# EAGLE design MicroMod_CAN-Bus_Function_Board (EAGLE 9.6.2)
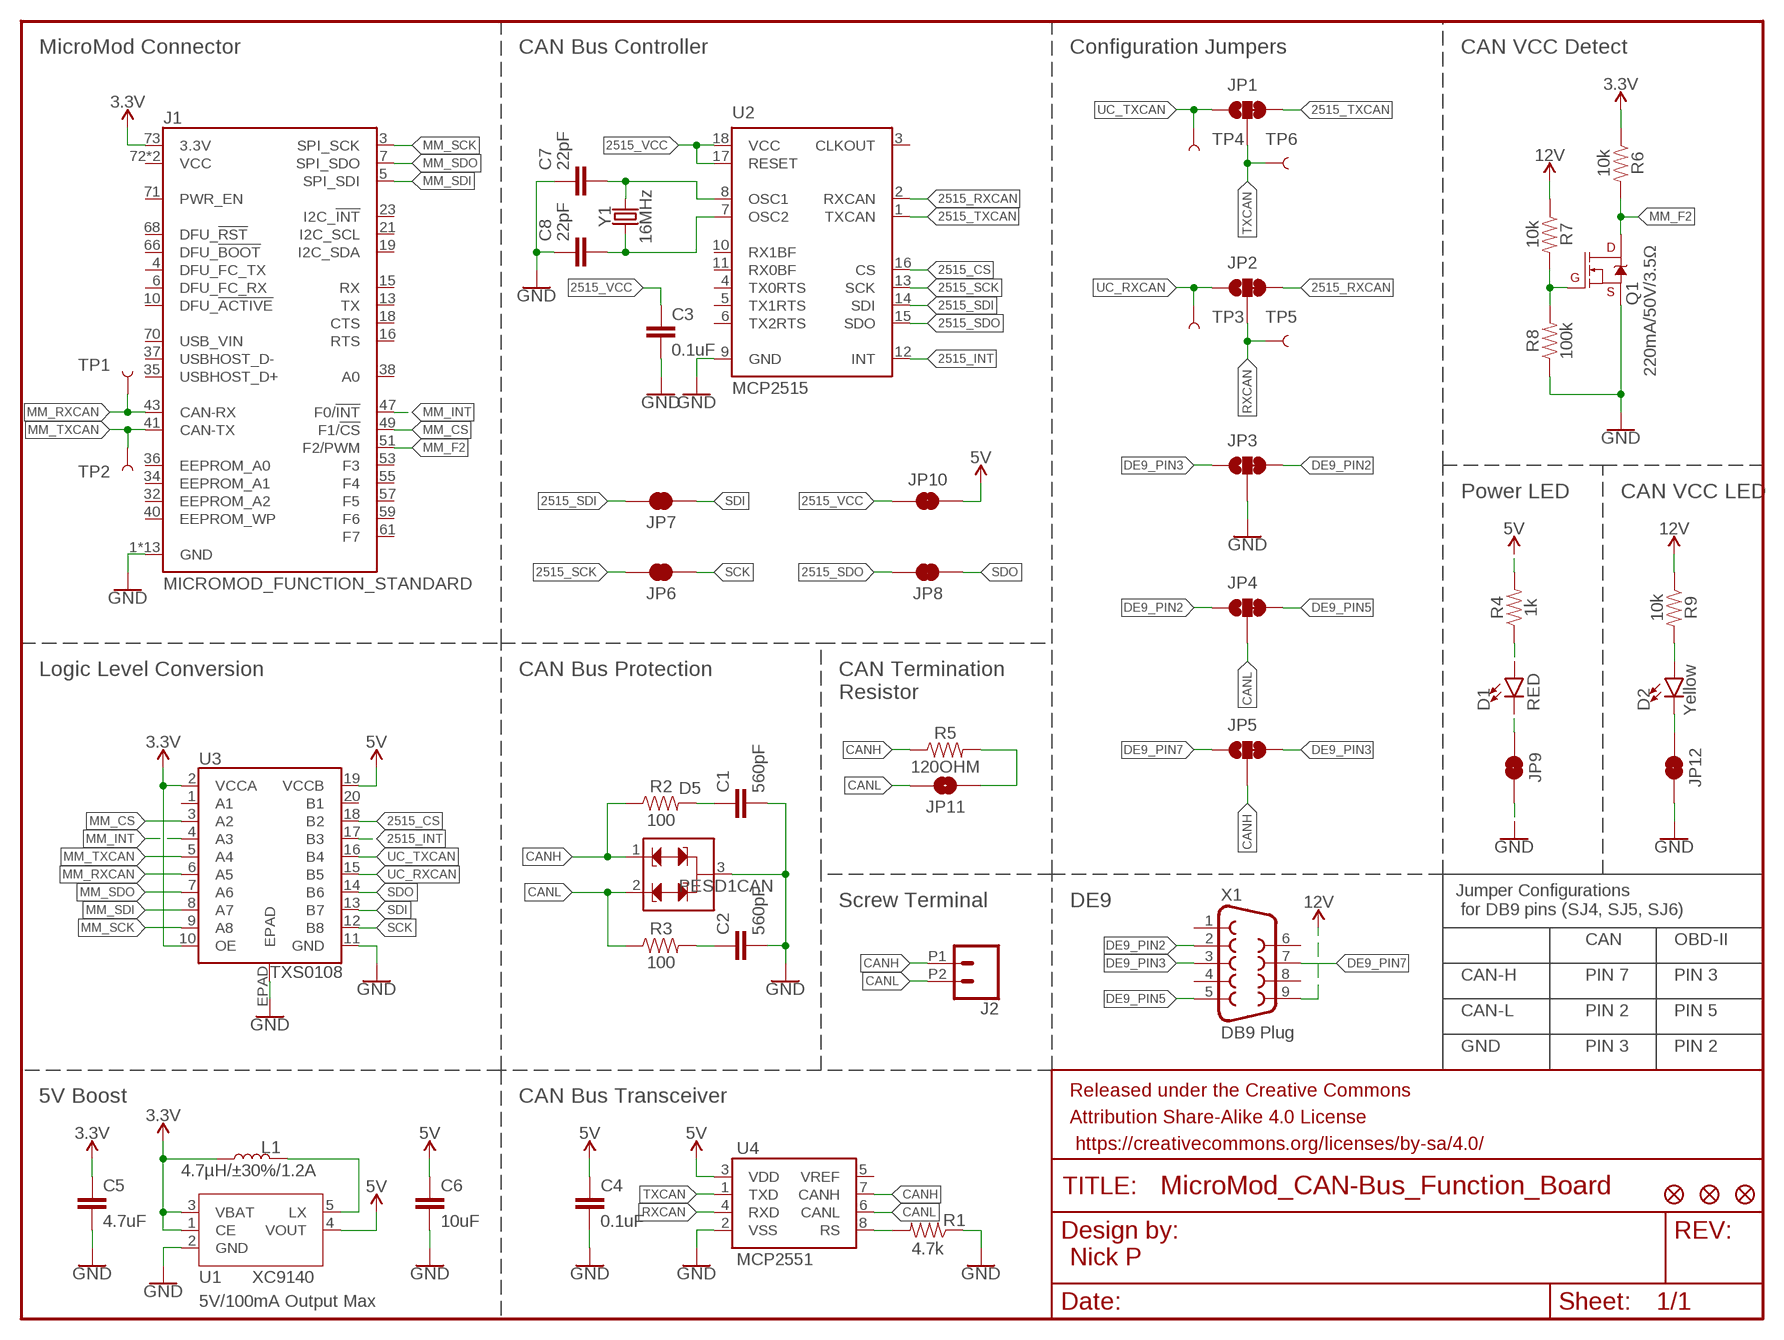
[diagram p0: schematic, sheet 1]

## Parts
C1  560pF  560PF-0603-50V-5%  [0603]
C2  560pF  560PF-0603-50V-5%  [0603]
C3  0.1uF  0.1UF-0603-25V-(+80/-20%)  [0603]
C4  0.1uF  0.1UF-0603-25V-(+80/-20%)  [0603]
C5  4.7uF  4.7UF-0603-6.3V-(10%)  [0603]
C6  10uF  10UF-0603-6.3V-20%  [0603]
C7  22pF  22PF-0603-50V-5%  [0603]
C8  22pF  22PF-0603-50V-5%  [0603]
D1  RED  LED-RED0603  [LED-0603]
D2  Yellow  LED-YELLOW0603  [LED-0603]
D5  PESD1CAN  [SOT23-3]
FD1  FIDUCIAL1X2  [FIDUCIAL-1X2]
FD2  FIDUCIAL1X2  [FIDUCIAL-1X2]
FD3  FIDUCIAL0.2MM  [FIDUCIAL-0.2MM]
FRAME1  FRAME-LETTER  [CREATIVE_COMMONS]
J1  MICROMOD_FUNCTION_STANDARD  [M.2-CARD-E-22_FUNCTION_STANDARD]
J2  CONN_022.54MM_SCREWTERM  [1X02_2.54_SCREWTERM]
JP1  JUMPER-SMT_3_1-NC_TRACE_NO-SILK  [SMT-JUMPER_3_1-NC_TRACE_NO-SILK]
JP2  JUMPER-SMT_3_1-NC_TRACE_NO-SILK  [SMT-JUMPER_3_1-NC_TRACE_NO-SILK]
JP3  JUMPER-SMT_3_1-NC_TRACE_NO-SILK  [SMT-JUMPER_3_1-NC_TRACE_NO-SILK]
JP4  JUMPER-SMT_3_1-NC_TRACE_NO-SILK  [SMT-JUMPER_3_1-NC_TRACE_NO-SILK]
JP5  JUMPER-SMT_3_1-NC_TRACE_NO-SILK  [SMT-JUMPER_3_1-NC_TRACE_NO-SILK]
JP6  JUMPER-SMT_2_NC_TRACE_NO-SILK  [SMT-JUMPER_2_NC_TRACE_NO-SILK]
JP7  JUMPER-SMT_2_NC_TRACE_NO-SILK  [SMT-JUMPER_2_NC_TRACE_NO-SILK]
JP8  JUMPER-SMT_2_NC_TRACE_NO-SILK  [SMT-JUMPER_2_NC_TRACE_NO-SILK]
JP9  JUMPER-SMT_2_NC_TRACE_NO-SILK  [SMT-JUMPER_2_NC_TRACE_NO-SILK]
JP10  JUMPER-SMT_2_NC_TRACE_NO-SILK  [SMT-JUMPER_2_NC_TRACE_NO-SILK]
JP11  JUMPER-SMT_2_NO_NO-SILK  [SMT-JUMPER_2_NO_NO-SILK]
JP12  JUMPER-SMT_2_NC_TRACE_NO-SILK  [SMT-JUMPER_2_NC_TRACE_NO-SILK]
L1  4.7µH/±30%/1.2A  INDUCTOR-CDRH-4.7UH  [INDUCTOR_4.7UH]
Q1  220mA/50V/3.5Ω  MOSFET-NCH-BSS138  [SOT23-3]
R1  4.7k  4.7KOHM-0603-1/10W-1%  [0603]
R2  100  100OHM-0603-1/10W-1%  [0603]
R3  100  100OHM-0603-1/10W-1%  [0603]
R4  1k  1KOHM-0603-1/10W-1%  [0603]
R5  120OHM  [0603]
R6  10k  10KOHM-0603-1/10W-1%  [0603]
R7  10k  10KOHM-0603-1/10W-1%  [0603]
R8  100k  100KOHM-0603-1/10W-1%  [0603]
R9  10k  10KOHM-0603-1/10W-1%  [0603]
TP1  TEST-POINT3  [PAD.03X.03]
TP2  TEST-POINT3  [PAD.03X.03]
TP3  TEST-POINT3  [PAD.03X.03]
TP4  TEST-POINT3  [PAD.03X.03]
TP5  TEST-POINT3  [PAD.03X.03]
TP6  TEST-POINT3  [PAD.03X.03]
U1  XC9140  [SOT23-5]
U2  MCP2515  MCP2515(MCP2510)SO  [SO18W]
U3  TXS0108  TXS0108-VFQFN_20  [VFQFN-20]
U4  MCP2551  [SO08]
X1  DB9 Plug  DB9MALE  [DB9_MALE]
Y1  16MHz  CRYSTAL-16MHZSMD-2X1.6  [CRYSTAL-SMD-2.0X1.6MM]

## Nets
3.3V: C5.1 J1.73(3.3V) L1.P$2 R6.1 U1.1(CE) U1.3(VBAT) U3.2(VCCA) U3.10(OE)
5V: C4.1 C6.1 JP10.2 R4.2 U1.4(VOUT) U3.19(VCCB) U4.3(VDD)
12V: R7.1 R9.1 X1.9
2515_CS: U2.16(CS) U3.18(B2)
2515_INT: U2.12(INT) U3.17(B3)
2515_RXCAN: JP2.3 U2.2(RXCAN)
2515_SCK: JP6.2 U2.13(SCK)
2515_SDI: JP7.2 U2.14(SDI)
2515_SDO: JP8.2 U2.15(SDO)
2515_TXCAN: JP1.3 U2.1(TXCAN)
2515_VCC: C3.1 JP10.1 U2.17(RESET) U2.18(VCC)
CANH: D5.1 J2.P1 JP5.2 R2.1 R5.1 U4.7(CANH)
CANL: D5.2 J2.P2 JP4.2 JP11.2 R3.1 U4.6(CANL)
DE9_PIN2: JP3.3 JP4.1 X1.2
DE9_PIN3: JP3.1 JP5.3 X1.3
DE9_PIN5: JP4.3 X1.5
DE9_PIN7: JP5.1 X1.7
GND: C1.2 C2.2 C3.2 C4.2 C5.2 C6.2 C7.1 C8.1 D5.3 J1.1(GND) J1.2(GND) J1.8(GND) J1.33(GND) J1.39(GND) J1.45(GND) J1.75(GND) J1.GND1(GND) J1.GND2(GND) J1.GND3(GND) J1.GND4(GND) J1.GND5(GND) J1.GND6(GND) JP3.2 JP9.2 JP12.2 Q1.2(S) R1.1 R8.1 U1.2(GND) U2.9(GND) U3.11(GND) U4.2(VSS)
MM_CS: J1.49(F1/!CS!) U3.3(A2)
MM_F2: J1.51(F2/PWM) Q1.3(D) R6.2
MM_INT: J1.47(F0/!INT!) U3.4(A3)
MM_RXCAN: J1.43(CAN-RX) TP1.1 U3.6(A5)
MM_SCK: J1.3(SPI_SCK) U3.9(A8)
MM_SDI: J1.5(SPI_SDI) U3.8(A7)
MM_SDO: J1.7(SPI_SDO) U3.7(A6)
MM_TXCAN: J1.41(CAN-TX) TP2.1 U3.5(A4)
N$1: C1.1 R2.2
N$2: C2.1 R3.2
N$3: C7.2 U2.8(OSC1) Y1.3
N$4: L1.P$1 U1.5(LX)
N$5: C8.2 U2.7(OSC2) Y1.1
N$6: JP11.1 R5.2
N$7: D1.C JP9.1
N$8: D1.A R4.1
N$9: R1.2 U4.8(RS)
N$10: Q1.1(G) R7.2 R8.2
N$11: D2.A R9.2
N$12: D2.C JP12.1
N$13: U3.EPAD ; supply symbol labelled GND
RXCAN: JP2.2 TP5.1 U4.4(RXD)
SCK: JP6.1 U3.12(B8)
SDI: JP7.1 U3.13(B7)
SDO: JP8.1 U3.14(B6)
TXCAN: JP1.2 TP6.1 U4.1(TXD)
UC_RXCAN: JP2.1 TP3.1 U3.15(B5)
UC_TXCAN: JP1.1 TP4.1 U3.16(B4)
Unconnected: J1.4(DFU_FC_TX) J1.6(DFU_FC_RX) J1.10(DFU_!ACTIVE!) J1.13(TX) J1.15(RX) J1.16(RTS) J1.18(CTS) J1.19(I2C_SDA) J1.21(I2C_SCL) J1.23(I2C_!INT!) J1.32(EEPROM_A2) J1.34(EEPROM_A1) J1.35(USBHOST_D+) J1.36(EEPROM_A0) J1.37(USBHOST_D-) J1.38(A0) J1.40(EEPROM_WP) J1.53(F3) J1.55(F4) J1.57(F5) J1.59(F6) J1.61(F7) J1.66(DFU_!BOOT!) J1.68(DFU_!RST!) J1.70(USB_VIN) J1.71(PWR_EN) J1.72(VCC) J1.74(VCC) U2.3(CLKOUT) U2.4(TX0RTS) U2.5(TX1RTS) U2.6(TX2RTS) U2.10(RX1BF) U2.11(RX0BF) U3.1(A1) U3.20(B1) U4.5(VREF) X1.1 X1.4 X1.6 X1.8

## Notes on the sheet
- MicroMod Connector | CAN Bus Controller | Configuration Jumpers | CAN VCC Detect
- Power LED | CAN VCC LED
- Logic Level Conversion | CAN Bus Protection
- CAN Termination
  Resistor
- Screw Terminal | DE9
- Jumper Configurations
   for DB9 pins (SJ4, SJ5, SJ6)
- CAN | OBD-II
- CAN-H | PIN 7 | PIN 3
- CAN-L | PIN 2 | PIN 5
- GND | PIN 3 | PIN 2
- 5V Boost | CAN Bus Transceiver
- Nick P
- 5V/100mA Output Max

## Library data of the parts
C1 C2 = SparkFun-Capacitors:560PF: 0.56nF/560pF ceramic capacitors A capacitor is a passive two-terminal electrical component used to store electrical energy temporarily in an electric field.; PROD_ID: CAP-08749
C3 C4 = SparkFun-Capacitors:0.1UF: 0.1µF ceramic capacitors A capacitor is a passive two-terminal electrical component used to store electrical energy temporarily in an electric field.; PROD_ID: CAP-00810
C5 = SparkFun-Capacitors:4.7UF: 4.7µF ceramic capacitors A capacitor is a passive two-terminal electrical component used to store electrical energy temporarily in an electric field.; PROD_ID: CAP-08280
C6 = SparkFun-Capacitors:10UF: 10.0µF ceramic capacitors A capacitor is a passive two-terminal electrical component used to store electrical energy temporarily in an electric field.; PROD_ID: CAP-11015
C7 C8 = SparkFun-Capacitors:22PF: 22pF ceramic capacitors A capacitor is a passive two-terminal electrical component used to store electrical energy temporarily in an electric field.; PROD_ID: CAP-07876
D1 = SparkFun-LED:LED-RED: Red SMD LED Used in manufacturing of most products at SparkFun Packages: 0603 - SMD 0603 package [Product Link] <http://docs.avagotech.com/docs/AV02-0551EN> 0603 SMART - SMD 0603 SMART package ( more efficient and expensive)[Product Link] <http://www.osram-os.com/Graphics/XPic2/00077099_0.pdf> 1206 - SMD1206 package [Product Link] <https://www.sparkfun.com/datasheets/DevTools/LilyPad/Q150OVS4.pdff> SparkFun Products: Pro Mini 328 -5V <https://www.sparkfun.com/products/821> RedBoard <https://www.sparkfun.com/products/12757> IOIO-OTG <https://www.sparkfun.com/products/13613>; PROD_ID: DIO-00819
D2 = SparkFun-LED:LED-YELLOW: Yellow SMD LED Used in manufacturing several products at SparkFun. Packages: 0603 - SMD 0603 package[Product Link] <http://www.kingbrightusa.com/product.asp?catalog_name=LED&product_id=APT1608SYCK> 0603 -SMART - SMART SMD 0603 package (more efficient/more expensive) [Product Link] <http://www.osram-os.com/osram_os/en/products/product-catalog/led-light-emitting-diodes/smartled-0603/ly-l29k/index.jsp> LilyPad - SMD1206 package[Product Datasheet] <https://www.sparkfun.com/datasheets/DevTools/LilyPad/Q150YUS4.pdf> SparkFun Products: Blynk Board <https://www.sparkfun.com/products/13794> IOIO-OTG <https://www.sparkfun.com/products/13613> XBee Explorer Serial <https://www.sparkfun.com/products/13225>; PROD_ID: DIO-09003
D5 = SparkFun-DiscreteSemi:PESD1CAN: CAN bus ESD protection diode PESD1CAN is used to protect two CAN bus lines from ESD. Link to datasheet <http://www.nxp.com/documents/data_sheet/PESD1CAN-U.pdf> SparkFun Products: SparkFun CAN-BUS Shield <https://www.sparkfun.com/products/13262>; PROD_ID: DIO-12501
FD1-FD3 = SparkFun-Aesthetics:FIDUCIAL: Fiducial Alignment Points Point-of-reference for pick-and-place machines and other optical instruments.
FRAME1 = SparkFun-Aesthetics:FRAME-LETTER: Schematic Frame - Letter Standard 8.5x11 US Letter frame
J1 = SparkFun-MicroMod:MICROMOD_FUNCTION: MicroMod Connector Description: A card edge connector and mating PCB connector to allow various MicroMod Processor Boards to be coupled with various carrier boards of different capabilities. Based on the M.2 standard.
J2 = SparkFun-Connectors:CONN_02: Multi connection point. Often used as Generic Header-pin footprint for 0.1 inch spaced/style header connections On any of the 0.1 inch spaced packages, you can populate with these: Break Away Headers - Straight <https://www.sparkfun.com/products/116> (PRT-00116) Break Away Male Headers - Right Angle <https://www.sparkfun.com/products/553> (PRT-00553) Female Headers <https://www.sparkfun.com/products/115> (PRT-00115) Break Away Headers - Machine Pin <https://www.sparkfun.com/products/117> (PRT-00117) Break Away Female Headers - Swiss Machine Pin <https://www.sparkfun.com/products/743> (PRT-00743) For SCREWTERMINALS and SPRING TERMINALS visit here: Screw Terimnals on SparkFun.com <https://www.sparkfun.com/search/results?term=Screw+Terminals> (5mm/3.5mm/2.54mm spacing) This device is also useful as a general connection point to wire up your design to another part of your project. Our various solder wires solder well into these plated through hole pads. Hook-Up Wire - Assortment (Stranded, 22 AWG) <https://www.sparkfun.com/products/11375> (PRT-11375) Hook-Up Wire - Assortment (Solid Core, 22 AWG) <https://www.sparkfun.com/products/11367> (PRT-11367) View the entire wire category on our website here <https://www.sparkfun.com/categories/141> Special notes: Molex polarized connector foot print use with: PRT-08233 with associated crimp pins and housings. 2.54_SCREWTERM for use with PRT-10571. 3.5mm Screw Terminal footprints for PRT-08084 5mm Screw Terminal footprints for use with PRT-08432
JP1-JP5 = SparkFun-Jumpers:JUMPER-SMT_3_1-NC_TRACE: Normally closed trace jumper (1 of 2 connections) This jumper has a trace between two pads so it's normally closed (NC). The other connection is normally open (NO). Use a razor knife to open the connection. For best results follow the IPC guidelines for cutting traces: Cutout at least 0.063 mm (0.005 in). Remove all loose material to clean up the cut area. Seal the cut with an approved epoxy. Reapply solder to reclose the connection, or to close the NO connection.
JP6-JP10 JP12 = SparkFun-Jumpers:JUMPER-SMT_2_NC_TRACE: Normally closed trace jumper This jumper has a trace between two pads so it's normally closed (NC). Use a razor knife to open the connection. For best results follow the IPC guidelines for cutting traces: Cutout at least 0.063 mm (0.005 in). Remove all loose material to clean up the cut area. Seal the cut with an approved epoxy. Reapply solder to reclose the connection.
JP11 = SparkFun-Jumpers:JUMPER-SMT_2_NO: Normally open jumper This jumper has two pads in close proximity to each other. Apply solder to close the connection. Round pads are easier to solder for beginners, but are a lot larger. SparkFun Product that uses the round pads: SparkFun EL Sequencer <https://www.sparkfun.com/products/12781>
L1 = SparkFun-Coils:INDUCTOR: Inductors Resist changes in electrical current. Basically a coil of wire. SparkFun Products: SparkFun Load Cell Amplifier - HX711 <https://www.sparkfun.com/products/13879> IOIO-OTG - V2.2 <https://www.sparkfun.com/products/13613>; PROD_ID: NDUC-10146
Q1 = SparkFun-DiscreteSemi:MOSFET-NCH: N-channel MOSFETs Voltage controlled devices that allow control of high current outputs. SparkFun Products: SparkFun OpenScale <https://www.sparkfun.com/products/13261> SparkFun Digital Sandbox <https://www.sparkfun.com/products/12651> SparkFun Monster Moto Shield <https://www.sparkfun.com/products/10182> SparkFun MOSFET Power Controller <https://www.sparkfun.com/products/11214>; PROD_ID: TRANS-00830
R1 = SparkFun-Resistors:4.7KOHM: 4.7kΩ resistor A resistor is a passive two-terminal electrical component that implements electrical resistance as a circuit element. Resistors act to reduce current flow, and, at the same time, act to lower voltage levels within circuits. - Wikipedia; PROD_ID: RES-07857
R2 R3 = SparkFun-Resistors:100OHM: 100Ω resistor A resistor is a passive two-terminal electrical component that implements electrical resistance as a circuit element. Resistors act to reduce current flow, and, at the same time, act to lower voltage levels within circuits. - Wikipedia; PROD_ID: RES-07863
R4 = SparkFun-Resistors:1KOHM: 1kΩ resistor A resistor is a passive two-terminal electrical component that implements electrical resistance as a circuit element. Resistors act to reduce current flow, and, at the same time, act to lower voltage levels within circuits. - Wikipedia; PROD_ID: RES-07856
R5 = SparkFun-Resistors:120OHM: 120Ω resistor A resistor is a passive two-terminal electrical component that implements electrical resistance as a circuit element. Resistors act to reduce current flow, and, at the same time, act to lower voltage levels within circuits. - Wikipedia
R6 R7 R9 = SparkFun-Resistors:10KOHM: 10kΩ resistor A resistor is a passive two-terminal electrical component that implements electrical resistance as a circuit element. Resistors act to reduce current flow, and, at the same time, act to lower voltage levels within circuits. - Wikipedia; PROD_ID: RES-00824
R8 = SparkFun-Resistors:100KOHM: 100kΩ resistor A resistor is a passive two-terminal electrical component that implements electrical resistance as a circuit element. Resistors act to reduce current flow, and, at the same time, act to lower voltage levels within circuits. - Wikipedia; PROD_ID: RES-07828
TP1-TP6 = SparkFun-Connectors:TEST-POINT: SparkFun Test Points Bare copper test points for troubleshooting or In-Circuit-Testing. These are used by our Production team for verifying production board runs using pogo-pins on test beds. SparkFun Products: SparkFun LSM9DS1 Breakout <https://www.sparkfun.com/products/13284> SparkFun PSOC <https://www.sparkfun.com/products/13714> SparkFun Load Cell Amplifier <https://www.sparkfun.com/products/13879>
U1 = SparkFun-IC-Power:XC9140
U2 = SparkFun-IC-Comms:MCP2515(MCP2510): CAN controller with SPI interface The MCP2515 controller supercedes the MCP2510 while addressing all errata associated with it. The two devices are pin compatible, either can be used with this device. 18-pin package SOIC Simple SPI interface to any MCU. One-shot mode ensures message transmission is attempted only once Databyte filtering Start-of-Frame (SOF) output Low-power CMOS Technology Datasheet <http://www.sparkfun.com/datasheets/DevTools/Arduino/MCP2515.pdf> SparkFun Products CAN-BUS Shield <https://www.sparkfun.com/products/13262> (DEV-13262); PROD_ID: IC-09906
U3 = SparkFun-IC-Comms:TXS0108: 8-Bit Bi-Directional Level Shifter For Open-Drain and Push-Pull 1.2V-3.6V (VCCA) to 1.65V-5.5V (VCCB) bi-directional level shifter with auto direction sensing. Max data rate - VCCA 1.2V: 20Mbps (50ns), VCCA 3.3V: 100Mbps (10ns) Digikey: 296-24806-2-ND (20-VFDFN) SparkFun Products Example Product (SKU); PROD_ID: IC-14343
U4 = SparkFun-IC-Comms:MCP2551: MCP2551 High Speed CAN Transceiver High speed CAN transceiver Datasheet <http://www.sparkfun.com/datasheets/DevTools/Arduino/MCP2551.pdf> SparkFun Products CAN-BUS Shield <https://www.sparkfun.com/products/13262> (DEV-13262) SparkFun OBD-II UART <https://www.sparkfun.com/products/9555> (WIG-09555); PROD_ID: IC-09907
X1 = SparkFun-Connectors:DB9: DB9 Connector Standard DB9 (D-Sub 9) serial connector. Can be used for CAN bus as well as RS485 and RS232. Footprint production proven. Spark Fun Electronics SKU : PRT-00429; PROD_ID: CONN-09904
Y1 = SparkFun-Clocks:CRYSTAL-16MHZ: 16MHz Crystal Digikey Example <http://www.digikey.com/product-search/en?keywords=535-9122-1-ND> Frequency: 16MHz Frequency Stability: ±50ppm Frequency Tolerance: ±20ppm Load Capacitance: 18pF SparkFun Products: Pro Micro -5V/16MHz <https://www.sparkfun.com/products/12640> SparkFun Serial Enabled LCD Kit <https://www.sparkfun.com/products/10097>; PROD_ID: XTAL-14681

## Net classes
0 default: width 0 mm, drill 0 mm

## Board
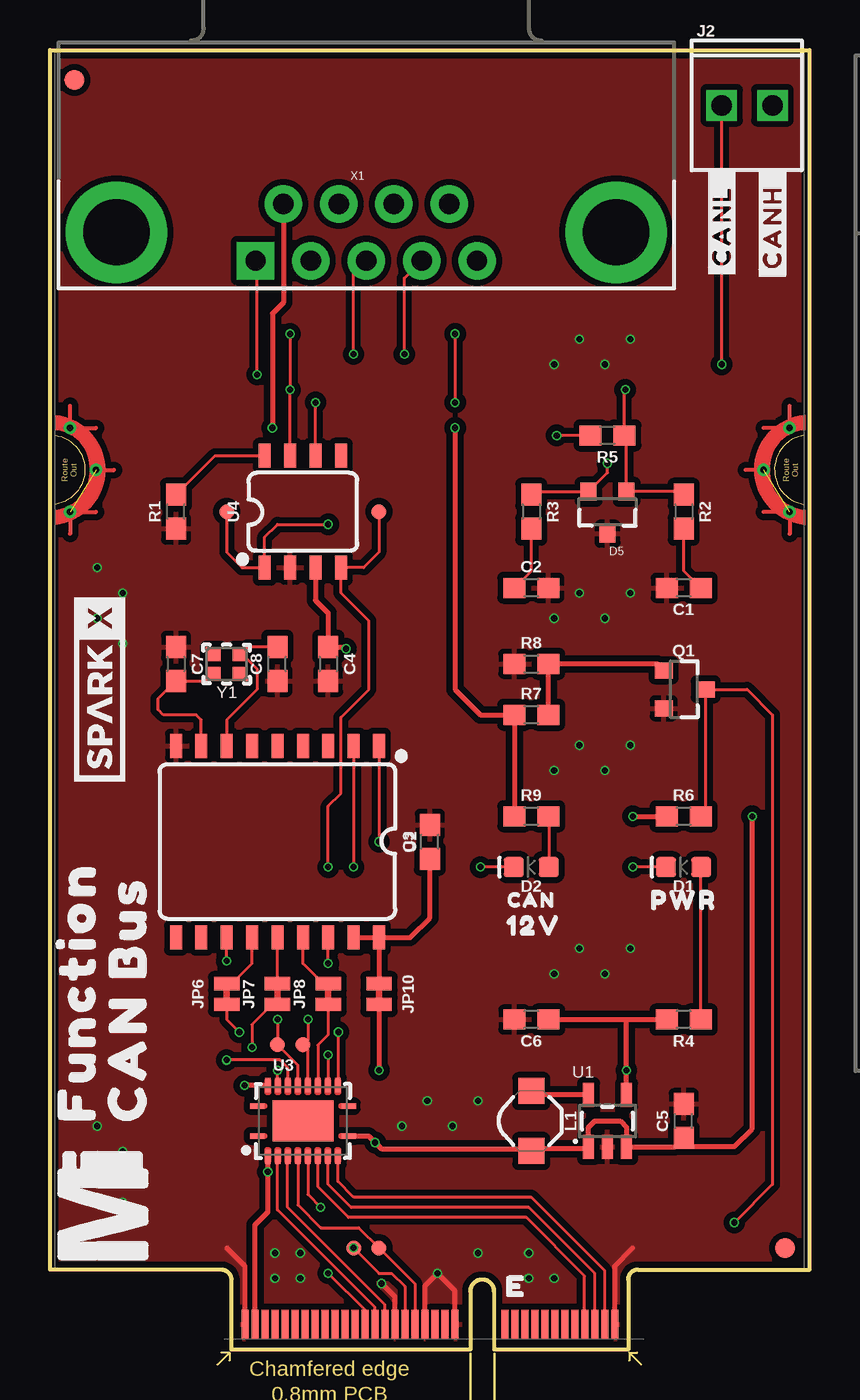
[diagram p1: board, top side]
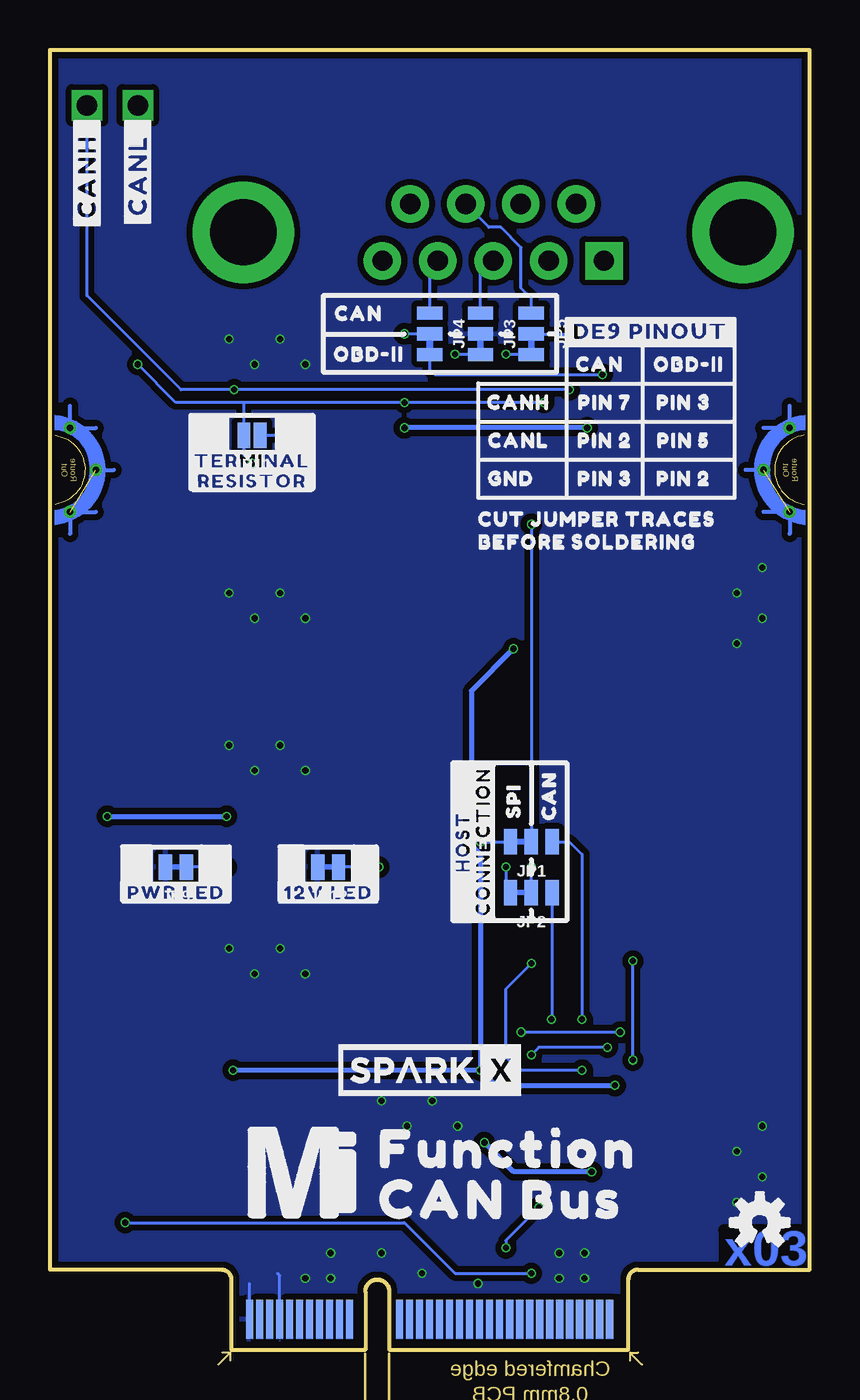
[diagram p2: board, bottom side, seen from below]

Size 38 x 65 mm. Coordinates in mm from the lower left corner, seen from the top.
Outline: 28.93,0 22.22,0 22.22,2.9 arc180 21.02,2.9 21.02,0 9.07,0 9.07,3.5 arc84 8.6,4 0,4 0,65 38,65 38,4 29.4,4 arc85 28.93,3.5 28.93,0
Copper layers (1+2*15+16): Top 0.035mm / dielectric 1.5mm / Route2 0.035mm / dielectric 0.15mm / Route15 0.035mm / dielectric 0.2mm / Bottom 0.035mm
Design rules "SparkFun-4-Layer-MicroMod-JLCPCB": minimum track width 4mil, minimum drill 0.2mm, track to track 4mil, track to pad 4mil, pad to pad 4mil, via to via 4mil, smd to smd 4mil, copper to edge 6mil, drill to drill 6mil, minimum pad ring 3mil, minimum via ring 3mil, stop-mask expansion 4mil, vias tented up to drill 25mil, thermal gap 10mil

### Footprints (pad centres in the part's own frame; a part is rotated, then mirrored left to right if it is on the bottom)
0603 = smd 1.1 x 1: 1 -0.85,0; 2 0.85,0
LED-0603 = smd 1 x 1: A -0.877,0; C 0.877,0
SOT23-3 = smd 0.8 x 0.9: 1 -0.95,-1; 2 0.95,-1; 3 0,1.1
FIDUCIAL-1X2 = smd 1 x 1: 1 0,0
FIDUCIAL-0.2MM = smd 0.2 x 0.2: 1 0,0
M.2-CARD-E-22_FUNCTION_STANDARD = smd 0.35 x 1.45: 1 9.25,1.275; 3 8.75,1.275; 5 8.25,1.275; 7 7.75,1.275; 9 7.25,1.275; 11 6.75,1.275; 13 6.25,1.275; 15 5.75,1.275; 17 5.25,1.275; 19 4.75,1.275; 21 4.25,1.275; 23 3.75,1.275; 33 1.25,1.275; 35 0.75,1.275; 37 0.25,1.275; 39 -0.25,1.275; 41 -0.75,1.275; 43 -1.25,1.275; 45 -1.75,1.275; 47 -2.25,1.275; 49 -2.75,1.275; 51 -3.25,1.275; 53 -3.75,1.275; 55 -4.25,1.275; 57 -4.75,1.275; 59 -5.25,1.275; 61 -5.75,1.275; 63 -6.25,1.275; 65 -6.75,1.275; 67 -7.25,1.275; 69 -7.75,1.275; 71 -8.25,1.275; 73 -8.75,1.275; 75 -9.25,1.275 | smd 0.35 x 1.95 bottom: 2 9,1.525; 4 8.5,1.525; 6 8,1.525; 8 7.5,1.525; 10 7,1.525; 12 6.5,1.525; 14 6,1.525; 16 5.5,1.525; 18 5,1.525; 20 4.5,1.525; 22 4,1.525; 32 1.5,1.525; 34 1,1.525; 36 0.5,1.525; 38 0,1.525; 40 -0.5,1.525; 42 -1,1.525; 44 -1.5,1.525; 46 -2,1.525; 48 -2.5,1.525; 50 -3,1.525; 52 -3.5,1.525; 54 -4,1.525; 56 -4.5,1.525; 58 -5,1.525; 60 -5.5,1.525; 62 -6,1.525; 64 -6.5,1.525; 66 -7,1.525; 68 -7.5,1.525; 70 -8,1.525; 72 -8.5,1.525; 74 -9,1.525 | drill 0.305 pad 0.61: GND1 -18,41.9; GND2 -16.7,44; GND3 -18,46.1; GND4 18,41.9; GND5 16.7,44; GND6 18,46.1
1X02_2.54_SCREWTERM = drill 1.016 square: P1 2.54,0; P2 0,0
SMT-JUMPER_3_1-NC_TRACE_NO-SILK = smd 0.66 x 1.27: 1 -1.041,0; 2 0,0; 3 1.041,0
SMT-JUMPER_2_NC_TRACE_NO-SILK = smd 0.66 x 1.27: 1 -0.521,0; 2 0.521,0
SMT-JUMPER_2_NO_NO-SILK = smd 0.635 x 1.27: 1 -0.406,0; 2 0.406,0
INDUCTOR_4.7UH = smd 1.3 x 1.3: P$1 -1.5,0; P$2 1.5,0
PAD.03X.03 = smd 0.762 x 0.762: 1 0,0
SOT23-5 = smd 0.55 x 1.2: 1 -0.95,-1.3; 2 0,-1.3; 3 0.95,-1.3; 4 0.95,1.3; 5 -0.95,1.3
SO18W = smd 0.6 x 1.2: 1 -5.08,-4.788; 2 -3.81,-4.788; 3 -2.54,-4.788; 4 -1.27,-4.788; 5 0,-4.788; 6 1.27,-4.788; 7 2.54,-4.788; 8 3.81,-4.788; 9 5.08,-4.788; 10 5.08,4.788; 11 3.81,4.788; 12 2.54,4.788; 13 1.27,4.788; 14 0,4.788; 15 -1.27,4.788; 16 -2.54,4.788; 17 -3.81,4.788; 18 -5.08,4.788
VFQFN-20 = smd 0.7 x 0.28: 1 -2.3,-0.75; 10 2.3,-0.75; 11 2.3,0.75; 20 -2.3,0.75 | smd 0.28 x 0.7: 2 -1.75,-1.8; 3 -1.25,-1.8; 4 -0.75,-1.8; 5 -0.25,-1.8; 6 0.25,-1.8; 7 0.75,-1.8; 8 1.25,-1.8; 9 1.75,-1.8; 12 1.75,1.8; 13 1.25,1.8; 14 0.75,1.8; 15 0.25,1.8; 16 -0.25,1.8; 17 -0.75,1.8; 18 -1.25,1.8; 19 -1.75,1.8 | smd 3.05 x 2.05: EPAD 0,0
SO08 = smd 0.6 x 1.2: 1 -1.905,-2.8; 2 -0.635,-2.8; 3 0.635,-2.8; 4 1.905,-2.8; 5 1.905,2.8; 6 0.635,2.8; 7 -0.635,2.8; 8 -1.905,2.8
DB9_MALE = drill 1.016 pad 1.88: 1 5.54,-1.42; 2 2.77,-1.42; 3 0,-1.42; 4 -2.77,-1.42; 6 4.15,1.42; 7 1.38,1.42; 8 -1.38,1.42; 9 -4.15,1.42 | drill 1.016 pad 1.88 square: 5 -5.54,-1.42 | drill 3.302 pad 5.08: G1 -12.5,0; G2 12.5,0
CRYSTAL-SMD-2.0X1.6MM = smd 0.75 x 0.7: 1 -0.675,-0.5; 2 0.675,-0.5; 3 0.675,0.5; 4 -0.675,0.5

### Placement (x,y rotation side)
C1  31.7,38.1 180 top
C2  24.08,38.1 0 top
C3  19,25.4 90 top
C4  13.92,34.29 270 top
C5  31.7,11.43 90 top
C6  24.08,16.51 180 top
C7  6.3,34.29 270 top
C8  11.38,34.29 90 top
D1  31.7,24.13 180 top
D2  24.08,24.13 180 top
D5  27.89,41.91 180 top
FD1  1.22,63.5 0 top
FD2  36.78,5.08 0 top
FD3  1.22,5.08 0 top
FRAME1  -3.86,-11.43 0 top  (outside the outline)
J1  19,0 0 top
J2  33.61,62.23 0 top
JP1  13.92,25.4 180 bottom
JP2  13.92,22.86 180 bottom
JP3  16.46,50.8 270 bottom
JP4  19,50.8 270 bottom
JP5  13.92,50.8 270 bottom
JP6  8.84,17.78 90 top
JP7  11.38,17.78 90 top
JP8  13.92,17.78 90 top
JP9  31.7,24.13 180 bottom
JP10  16.46,17.78 270 top
JP11  27.89,45.72 180 bottom
JP12  24.08,24.13 180 bottom
L1  24.08,11.43 270 top
LOGO2  SPECIAL_INSTRUCTIONS-ORDERING  [ORDERING_INSTRUCTIONS]  40.31,64.73 0 top
Q1  31.7,33.02 270 top
R1  6.3,41.91 90 top
R2  31.7,41.91 270 top
R3  24.08,41.91 270 top
R4  31.7,16.51 180 top
R5  27.89,45.72 180 top
R6  31.7,26.67 0 top
R7  24.08,31.75 0 top
R8  24.08,34.29 0 top
R9  24.08,26.67 0 top
TP1  15.19,5.08 0 top
TP2  16.46,5.08 0 top
TP3  12.65,15.24 0 top
TP4  11.38,15.24 0 top
TP5  16.46,41.91 180 top
TP6  8.84,41.91 180 top
U1  27.89,11.43 0 top
U2  11.38,25.4 180 top
U3  12.65,11.43 0 top
U4  12.65,41.91 0 top
U$1  [MICROMOD_MI_LOGO_1]  2.62,7.24 90 top
U$2  [FUNCTION0]  1.35,10.03 90 top
U$3  [CAN_BUS0]  3.89,10.03 90 top
U$4  [SPARKX-MEDIUM]  2.49,33.02 90 top
U$5  [#CANH_#0]  36.15,53.34 90 top
U$6  [#CANL_#0]  33.61,53.47 90 top
U$7  [PWR0]  31.7,22.48 0 top
U$8  [CAN0]  24.08,22.48 0 top
U$9  [12V0]  24.21,21.21 0 top
U$10  [#TERMINAL#0]  27.89,44.45 0 bottom
U$11  [#RESISTOR#0]  27.89,43.43 0 bottom
U$12  [#PWR_LED#0]  31.7,22.86 0 bottom
U$13  [#12V_LED#0]  24.08,22.86 0 bottom
U$14  [CUT_JUMPER_TRACES0]  17.09,41.53 0 bottom
U$15  [#DE9_PINOUT#0]  7.95,50.93 0 bottom
U$16  [BEFORE_SOLDERING0]  17.09,40.39 0 bottom
U$17  [GND0]  14.94,43.56 0 bottom
U$18  [CAN0]  10.49,49.28 0 bottom
U$19  [OBD#II0]  6.05,49.28 0 bottom
U$20  [PIN_70]  10.24,47.37 0 bottom
U$21  [PIN_20]  10.24,45.47 0 bottom
U$22  [PIN_20]  6.3,43.56 0 bottom
U$23  [PIN_30]  6.3,47.37 0 bottom
U$24  [PIN_30]  10.24,43.56 0 bottom
U$25  [PIN_50]  6.3,45.47 0 bottom
U$26  [OBD#II0]  22.05,49.78 0 bottom
U$27  [CAN0]  22.56,51.82 0 bottom
U$28  [CAN0]  13.03,27.69 90 bottom
U$29  [SPI0]  14.81,27.43 90 bottom
U$30  [#CANL_#0]  33.61,56.01 90 bottom
U$31  [#CANH_#0]  36.15,55.88 90 bottom
U$32  [CANH0]  14.55,47.37 0 bottom
U$33  [CANL0]  14.55,45.47 0 bottom
U$34  [#HOST#0]  17.35,25.4 90 bottom
U$35  [#CONNECTION#0]  16.33,25.4 90 bottom
U$36  [MICROMOD_MI_LOGO_1]  25.35,8.89 0 bottom
U$37  [CAN_BUS0]  22.94,7.49 0 bottom
U$38  [FUNCTION0]  22.94,10.03 0 bottom
U$39  [SPARKX-MEDIUM]  19,13.97 0 bottom
U$40  [OSHW-LOGO-S]  2.49,6.35 0 bottom
X1  15.82,55.88 0 top
Y1  8.84,34.29 180 top

### Tracks (layer width: path | path; a pad name or v marks a point on that pad's centre or on a via)
3.3V  (via drill 0.3)
  Top 0.254: J1.73 10.25,6.24 10.9,6.89 v10.9,8.89 U3.2 | L1.P$2 24.2,10.04 | 24.2,10.04 26.86,10.04 U1.1 26.94,11.12 27.25,11.43 28.52,11.43 28.84,11.12 U1.3 31.25,10.13 C5.1 32.12,10.16 34.24,10.16 35.13,11.05 v35.13,26.67 | U3.10 15.94,10.68 v16.27,10.35 16.57,10.04 24.2,10.04 | v29.16,26.67 R6.1
  Bottom 0.254: v10.9,8.89 14.81,8.89 v16.27,10.35 | v35.13,26.67 v29.16,26.67
5V  (via drill 0.3)
  Top 0.254: C6.1 28.78,16.51 | 28.78,16.51 R4.2 | U1.4 v28.84,13.97 28.84,16.45 28.78,16.51 | U4.3 13.29,37.47 13.92,36.83 C4.1 14.72,35.14 v14.81,35.05 | JP10.2 v16.46,13.97 | v9.73,13.21 9.75,13.23 U3.19
  Bottom 0.254: v9.73,13.21 15.7,13.21 v16.46,13.97 | v16.46,13.97 v28.84,13.97 | v16.46,13.97 16.46,24.75 16.92,25.21 16.92,32.94 v14.81,35.05
12V  (via drill 0.3)
  Top 0.254: R9.1 R7.1 21.54,31.75 20.27,33.02 v20.27,46.1 | X1.9 11.67,52.37 11.13,51.82 v11.13,46.1
  Bottom 0.254: v11.13,46.1 v20.27,46.1
2515_CS  (via drill 0.3)
  Top 0.152: U3.18 11.38,13.25 v11.38,13.97 | v13.92,19.3 U2.16
  Bottom 0.152: v11.38,13.97 14.55,13.97 15.19,14.61 15.19,18.03 v13.92,19.3
2515_INT  (via drill 0.3)
  Top 0.152: v8.84,19.43 U2.12 | U3.17 11.9,14.09 11.51,14.48 v8.84,14.48
  Bottom 0.152: v8.84,14.48 v8.84,19.43
2515_RXCAN  (via drill 0.3)
  Top 0.152: U2.2 v15.19,24.13
  Bottom 0.152: v15.19,24.13 15.19,23.09 JP2.3
2515_SCK
  Top 0.152: JP6.2 9.11,18.3 10.11,19.3 U2.13
2515_SDI
  Top 0.152: JP7.2 U2.14
2515_SDO
  Top 0.152: JP8.2 13.65,18.3 12.65,19.3 U2.15
2515_TXCAN  (via drill 0.3)
  Top 0.152: U2.1 v16.46,25.4
  Bottom 0.152: v16.46,25.4 JP1.3
2515_VCC
  Top 0.254: U2.18 JP10.1 | U2.18 18.02,20.61 19,21.59 C3.1 | U2.17 U2.18
CANH  (via drill 0.3)
  Top 0.152: R2.1 31.55,42.91 D5.1 28.84,45.62 R5.1 28.74,47.97 v28.78,48.01 | U4.7 v12.01,48.01 v12.01,50.8
  Bottom 0.152: v12.01,48.01 v28.78,48.01 31.45,48.01 36.15,52.7 J2.P1 | JP5.2 v12.01,50.8
CANL  (via drill 0.3)
  Top 0.152: R3.1 24.23,42.91 D5.2 27.89,43.86 v27.89,44.32 | U4.6 v13.29,47.37 | v33.61,49.28 J2.P2 | v20.27,50.8 v20.27,47.37
  Bottom 0.152: v13.29,47.37 v20.27,47.37 28.27,47.37 | 28.27,47.37 31.7,47.37 v33.61,49.28 | JP4.2 v20.27,50.8 | v27.89,44.32 28.3,44.73 JP11.2 28.3,47.35 28.27,47.37
DE9_PIN2  (via drill 0.3)
  Top 0.152: v17.73,49.78 17.73,53.59 X1.2
  Bottom 0.152: X1.2 19,54.05 JP4.1 | JP3.3 17.7,49.76 v17.73,49.78
DE9_PIN3  (via drill 0.3)
  Top 0.152: v15.19,49.78 15.19,53.83 X1.3
  Bottom 0.152: JP3.1 16.46,53.83 X1.3 | JP5.3 15.16,49.76 v15.19,49.78
DE9_PIN5  (via drill 0.3)
  Top 0.152: v10.36,48.77 10.36,54.38 X1.5
  Bottom 0.152: JP4.3 19,49.02 18.75,48.77 v10.36,48.77
DE9_PIN7
  Bottom 0.152: JP5.1 13.92,52.58 14.43,53.09 14.43,55.12 15.44,56.13 16.04,56.13 X1.7
GND  (via drill 0.3)  (2 unrouted)
  Top 0.254: J1.1 28.25,4.17 29.16,5.08 | J1.39 18.75,3.18 v19.38,3.81 20.25,2.94 J1.33 | J1.45 17.25,2.64 v16.59,3.3 | J1.75 9.75,4.17 8.84,5.08
  Bottom 0.152: J1.2 28,3.29 28.02,3.3 | J1.8 26.5,3.69 26.62,3.81
  other vias: 11.25,3.56 12.52,3.56 12.52,4.83 11.25,4.83 21.41,4.83 23.95,3.56 25.22,3.56 23.95,4.83 2.36,8.64 2.36,11.18 3.63,9.91 3.63,7.37 17.6,11.18 20.14,11.18 18.87,12.45 21.41,12.45 25.22,18.8 27.76,18.8 26.49,20.07 29.03,20.07 25.22,28.96 27.76,28.96 26.49,30.23 29.03,30.23 25.22,36.58 27.76,36.58 26.49,37.85 29.03,37.85 3.63,35.31 3.63,37.85 2.36,36.58 2.36,39.12 25.22,49.28 27.76,49.28 26.49,50.55 29.03,50.55
  pour Top (isolate 0.305): -0.05,0 38.05,0 38.05,64.77 -0.05,64.77
  pour Bottom (isolate 0.305): -0.05,0 38.05,0 38.05,64.77 -0.05,64.77
MM_CS
  Top 0.152: J1.49 16.25,2.12 11.38,6.99 11.38,9.61 U3.3
MM_F2  (via drill 0.3)
  Top 0.152: R6.2 32.8,26.92 Q1.3 34.88,33.02 36.15,31.75 36.15,8.26 v34.24,6.35 | v13.92,3.81 15.75,1.98 J1.51
  Bottom 0.152: v34.24,6.35 20.27,6.35 17.73,3.81 v13.92,3.81
MM_INT
  Top 0.152: J1.47 16.75,2.25 11.89,7.11 11.89,9.62 U3.4
MM_RXCAN  (via drill 0.3)
  Top 0.152: v13.54,7.11 12.9,7.75 U3.6 | TP1.1 16.46,3.81 17.09,3.81 17.75,3.15 J1.43
  Bottom 0.152: v13.54,7.11 15.19,5.46 TP1.1
  other vias: 15.19,5.08
MM_SCK
  Top 0.152: J1.3 27.75,3.95 24.08,7.62 15.19,7.62 14.4,8.41 U3.9
MM_SDI
  Top 0.152: J1.5 27.25,3.81 23.95,7.11 15.06,7.11 13.9,8.28 U3.8
MM_SDO
  Top 0.152: J1.7 26.75,3.68 23.83,6.6 14.94,6.6 13.4,8.14 U3.7
MM_TXCAN
  Top 0.152: U3.5 12.4,7.24 13.54,6.1 15.44,6.1 TP2.1 18.25,3.29 J1.41
N$1
  Top 0.152: C1.1 31.7,38.95 R2.2
N$2
  Top 0.152: C2.1 24.08,38.95 R3.2
N$3
  Top 0.152: Y1.3 7.82,33.44 C7.2 5.41,32.55 5.41,32 5.67,31.75 7.32,31.75 7.57,31.5 U2.8
N$4
  Top 0.254: U1.5 24.28,12.73 L1.P$1
N$5
  Top 0.152: U2.7 8.84,31.5 10.36,33.02 10.36,34.04 9.61,34.79 Y1.1 9.86,35.14 C8.2
N$6  (via drill 0.3)
  Top 0.152: R5.2 v25.35,45.72
  Bottom 0.152: v25.35,45.72 JP11.1
N$7  (via drill 0.3)
  Top 0.152: D1.C v29.16,24.13
  Bottom 0.152: v29.16,24.13 JP9.1
N$8
  Top 0.152: R4.1 32.55,24.1 D1.A
N$9
  Top 0.152: R1.2 8.25,44.71 U4.8
N$10
  Top 0.254: R7.2 R8.2 30.38,34.29 Q1.1
N$11
  Top 0.152: R9.2 24.96,26.64 D2.A
N$12  (via drill 0.3)
  Top 0.152: D2.C v21.54,24.13
  Bottom 0.152: v21.54,24.13 JP12.1
RXCAN  (via drill 0.3)
  Top 0.152: TP5.1 16.46,39.88 15.69,39.11 14.68,39.11 | 14.68,39.11 U4.4 | v13.92,24.13 13.92,27.18 14.55,27.81 14.55,31.62 15.95,33.02 15.95,36.45 14.55,37.85 14.55,38.98 14.68,39.11
  Bottom 0.152: JP2.2 v13.92,24.13
SCK  (via drill 0.3)
  Top 0.152: JP6.1 8.84,16.5 8.85,16.5 v9.47,15.88 | v14.43,15.88 14.4,15.85 U3.12
  Bottom 0.152: v9.47,15.88 v14.43,15.88
SDI  (via drill 0.3)
  Top 0.152: JP7.1 11.11,17.26 10.11,16.26 v10.11,15.11 | v13.92,14.73 13.9,14.71 U3.13
  Bottom 0.152: v10.11,15.11 13.54,15.11 v13.92,14.73
SDO
  Top 0.152: JP8.1 13.92,15.75 13.4,15.23 U3.14
TXCAN  (via drill 0.3)
  Top 0.152: TP6.1 8.84,39.88 9.61,39.11 U4.1 10.74,40.64 11.38,41.27 v13.92,41.27
  Bottom 0.152: v13.92,41.27 JP1.2
UC_RXCAN  (via drill 0.3)
  Top 0.152: U3.15 12.9,14.99 TP3.1 12.9,15.49 v12.9,16.51
  Bottom 0.152: JP2.1 12.88,16.54 v12.9,16.51
UC_TXCAN  (via drill 0.3)
  Top 0.152: U3.16 12.4,14.22 TP4.1 v11.38,16.51
  Bottom 0.152: JP1.1 12.01,25.4 11.38,24.77 v11.38,16.51

### Text on the board
Bottom: x03
tDocu: Board Thickness is 0.8mm | 2-Layer | Beveled Edge | ENIG Finish | Nick P